# EAGLE design apa102-2020-stick (EAGLE 7.6.0)
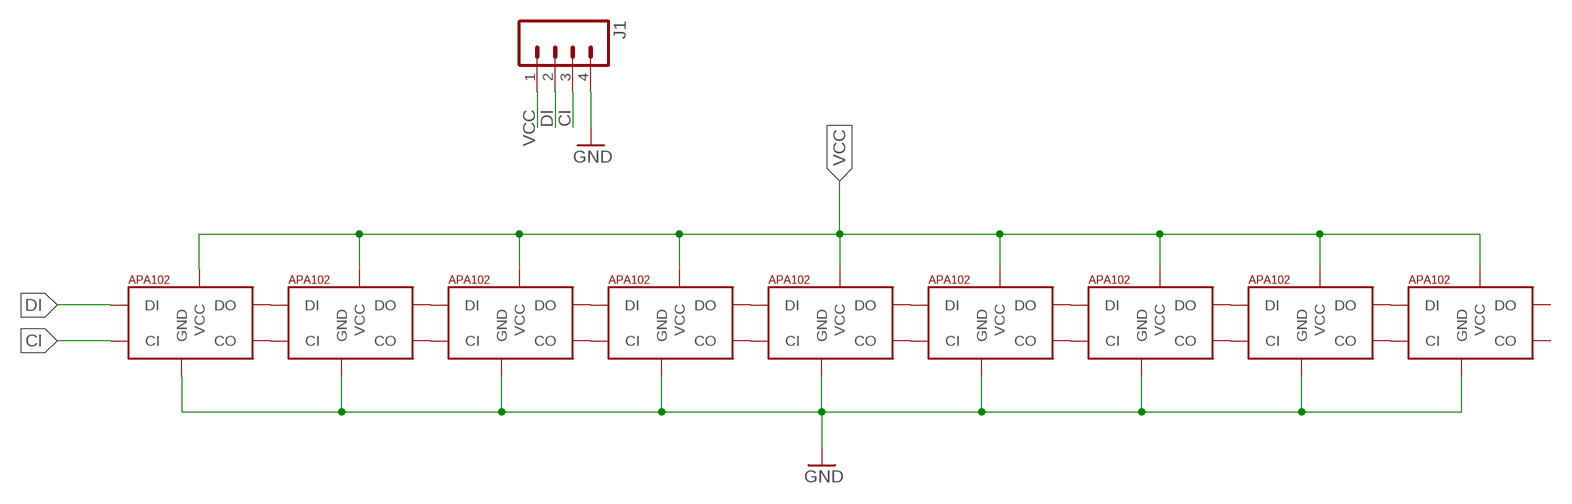
[diagram p0: schematic, sheet 1]

## Parts
J1  M04LOCK  [1X04_LOCK]
U$1  APA1022020  [APA102_2020]
U$2  APA1022020  [APA102_2020]
U$3  APA1022020  [APA102_2020]
U$4  APA1022020  [APA102_2020]
U$5  APA1022020  [APA102_2020]
U$6  APA1022020  [APA102_2020]
U$7  APA1022020  [APA102_2020]
U$8  APA1022020  [APA102_2020]
U$9  APA1022020  [APA102_2020]

## Nets
CI: J1.3 U$1.C_IN(CI)
DI: J1.2 U$1.D_IN(DI)
GND: J1.4 U$1.GND U$2.GND U$3.GND U$4.GND U$5.GND U$6.GND U$7.GND U$8.GND U$9.GND
N$1: U$1.D_OUT(DO) U$2.D_IN(DI)
N$2: U$1.CL_OUT(CO) U$2.C_IN(CI)
N$3: U$2.D_OUT(DO) U$3.D_IN(DI)
N$4: U$2.CL_OUT(CO) U$3.C_IN(CI)
N$5: U$3.D_OUT(DO) U$4.D_IN(DI)
N$6: U$3.CL_OUT(CO) U$4.C_IN(CI)
N$7: U$4.D_OUT(DO) U$5.D_IN(DI)
N$8: U$4.CL_OUT(CO) U$5.C_IN(CI)
N$9: U$5.D_OUT(DO) U$6.D_IN(DI)
N$10: U$5.CL_OUT(CO) U$6.C_IN(CI)
N$11: U$6.D_OUT(DO) U$7.D_IN(DI)
N$12: U$6.CL_OUT(CO) U$7.C_IN(CI)
N$13: U$7.D_OUT(DO) U$8.D_IN(DI)
N$14: U$7.CL_OUT(CO) U$8.C_IN(CI)
N$15: U$8.D_OUT(DO) U$9.D_IN(DI)
N$16: U$8.CL_OUT(CO) U$9.C_IN(CI)
VCC: J1.1 U$1.V_CC(VCC) U$2.V_CC(VCC) U$3.V_CC(VCC) U$4.V_CC(VCC) U$5.V_CC(VCC) U$6.V_CC(VCC) U$7.V_CC(VCC) U$8.V_CC(VCC) U$9.V_CC(VCC)
Unconnected: U$9.CL_OUT(CO) U$9.D_OUT(DO)

## Library data of the parts
J1 = SparkFun-Connectors:M04: Header 4 Standard 4-pin 0.1" header. Use with straight break away headers (SKU : PRT-00116), right angle break away headers (PRT-00553), swiss pins (PRT-00743), machine pins (PRT-00117), and female headers (PRT-00115). Molex polarized connector foot print use with SKU : PRT-08231 with associated crimp pins and housings. 1MM SMD Version SKU: PRT-10208; PROD_ID: CONN-09696
U$1-U$9 = jos-ph:APA102: APA102C 5050 RGB LED -- Adafruit DotStar Single LED Pixel Product Page: https://www.adafruit.com/products/2343 Datasheet: https://cdn-shop.adafruit.com/product-files/2343/APA102C.pdf

## Board
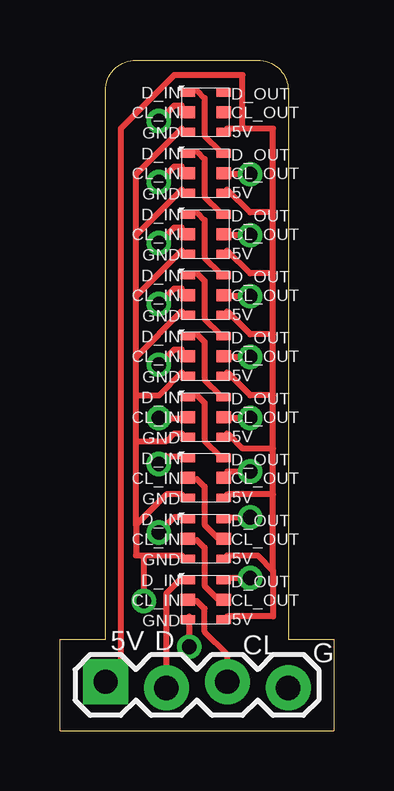
[diagram p1: board, top side]
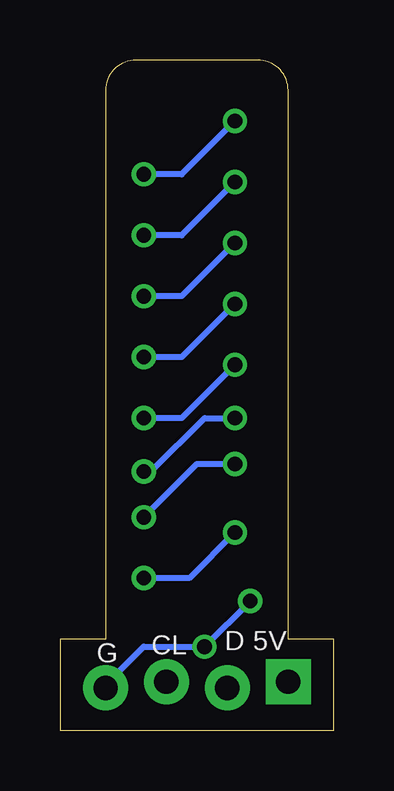
[diagram p2: board, bottom side, seen from below]

Size 11.43 x 27.94 mm. Coordinates in mm from the lower left corner, seen from the top.
Outline: 0,0 11.43,0 11.43,3.81 9.53,3.81 9.53,26.67 arc90 8.26,27.94 3.17,27.94 arc90 1.91,26.67 1.91,3.81 0,3.81 0,0
Copper layers (1*16): Top 0.035mm / dielectric 1.5mm / Bottom 0.035mm
Design rules "default": minimum track width 10mil, minimum drill 24mil, track to track 8mil, track to pad 8mil, pad to pad 8mil, via to via 8mil, smd to smd 8mil, copper to edge 40mil, drill to drill 8mil, minimum pad ring 10mil, minimum via ring 8mil, stop-mask expansion 4mil, vias tented up to drill 0mil, thermal gap 10mil

### Footprints (pad centres in the part's own frame; a part is rotated, then mirrored left to right if it is on the bottom)
1X04_LOCK = drill 1.016 pad 1.88 square: 1 0,0.127 | drill 1.016 pad 1.88: 2 2.54,-0.127; 3 5.08,0.127; 4 7.62,-0.127
APA102_2020 = smd 0.6 x 0.5: C_IN 0.25,1; CL_OUT 1.75,1 | smd 0.6 x 0.35: D_IN 0.25,1.825; D_OUT 1.75,1.825; GND 0.25,0.175; V_CC 1.75,0.175

### Placement (x,y rotation side)
J1  1.91,1.91 0 top
U$1  5.08,4.45 0 top
U$2  5.08,6.99 0 top
U$3  5.08,9.53 0 top
U$4  5.08,12.06 0 top
U$5  5.08,14.61 0 top
U$6  5.08,17.14 0 top
U$7  5.08,19.68 0 top
U$8  5.08,22.23 0 top
U$9  5.08,24.77 0 top

### Tracks (layer width: path | path; a pad name or v marks a point on that pad's centre or on a via)
CI
  Top 0.254: J1.3 6.99,3.17 6.03,4.13 6.03,5.08 5.71,5.4 5.4,5.4 U$1.C_IN
DI
  Top 0.254: J1.2 4.45,5.71 5.08,6.35 U$1.D_IN
GND  (via drill 0.61)
  Top 0.254: v5.4,3.49 5.4,4.76 U$1.GND | 3.49,7.3 3.17,7.3 3.17,8.57 | 3.49,7.3 5.08,7.3 U$2.GND | 3.17,8.57 4.45,9.84 5.08,9.84 U$3.GND | 3.17,12.06 4.45,12.06 4.76,12.38 5.08,12.38 U$4.GND | 3.17,8.57 3.17,12.06 | 3.17,13.97 4.13,13.97 5.08,14.92 U$5.GND | 3.17,12.06 3.17,13.97 | 3.17,15.56 5.08,17.46 U$6.GND | 3.17,13.97 3.17,15.56 | 3.17,18.1 5.08,20 U$7.GND | 3.17,15.56 3.17,18.1 | 3.17,20.64 5.08,22.54 U$8.GND | 3.17,18.1 3.17,20.64 | 3.17,20.64 3.17,23.18 5.08,25.08 U$9.GND | 3.49,7.3 v3.49,5.4
  Bottom 0.254: J1.4 9.53,1.91 7.94,3.49 v5.4,3.49 v3.49,5.4
N$1  (via drill 0.61)
  Top 0.254: v7.94,6.35 6.99,6.35 U$1.D_OUT | v4.13,8.26 4.76,8.89 5.08,8.89 U$2.D_IN
  Bottom 0.254: v7.94,6.35 6.03,6.35 v4.13,8.26
N$2
  Top 0.254: U$1.CL_OUT 6.67,5.4 6.03,6.03 6.03,7.62 5.71,7.94 5.4,7.94 U$2.C_IN
N$3  (via drill 0.61)
  Top 0.254: v4.13,11.11 4.13,11.43 5.08,11.43 U$3.D_IN | v7.94,8.89 6.99,8.89 U$2.D_OUT
  Bottom 0.254: v4.13,11.11 5.71,11.11 v7.94,8.89
N$4
  Top 0.254: U$2.CL_OUT 6.67,7.94 6.03,8.57 6.03,10.16 5.71,10.48 5.4,10.48 U$3.C_IN
N$5
  Top 0.254: U$3.D_OUT 6.67,11.43 6.03,12.06 6.03,13.65 5.71,13.97 5.4,13.97 U$4.D_IN
N$6  (via drill 0.61)
  Top 0.254: v4.13,13.02 5.08,13.02 U$4.C_IN | v7.94,10.79 6.99,10.79 6.99,10.48 U$3.CL_OUT
  Bottom 0.254: v4.13,13.02 5.4,13.02 7.62,10.79 v7.94,10.79
N$7
  Top 0.254: U$4.D_OUT 6.67,13.97 6.03,14.61 6.03,16.19 5.71,16.51 5.4,16.51 U$5.D_IN
N$8  (via drill 0.61)
  Top 0.254: v7.94,13.02 6.99,13.02 U$4.CL_OUT | v4.13,15.24 4.76,15.88 5.08,15.88 5.08,15.56 U$5.C_IN
  Bottom 0.254: v7.94,13.02 6.35,13.02 v4.13,15.24
N$9
  Top 0.254: U$5.D_OUT 6.67,16.51 6.03,17.14 6.03,18.73 5.71,19.05 5.4,19.05 U$6.D_IN
N$10  (via drill 0.61)
  Top 0.254: v7.94,15.56 6.99,15.56 U$5.CL_OUT | v4.13,17.78 4.76,18.41 5.08,18.41 5.08,18.1 U$6.C_IN
  Bottom 0.254: v7.94,15.56 6.35,15.56 v4.13,17.78
N$11
  Top 0.254: U$6.D_OUT 6.67,19.05 6.03,19.68 6.03,21.27 5.71,21.59 5.4,21.59 U$7.D_IN
N$12  (via drill 0.61)
  Top 0.254: v7.94,18.1 6.99,18.1 U$6.CL_OUT | v4.13,20.32 4.76,20.95 5.08,20.95 5.08,20.64 U$7.C_IN
  Bottom 0.254: v7.94,18.1 6.35,18.1 v4.13,20.32
N$13
  Top 0.254: U$7.D_OUT 6.67,21.59 6.03,22.23 6.03,23.81 5.71,24.13 5.4,24.13 U$8.D_IN
N$14  (via drill 0.61)
  Top 0.254: v7.94,20.64 6.99,20.64 U$7.CL_OUT | v4.13,22.86 4.76,23.5 5.08,23.5 5.08,23.18 U$8.C_IN
  Bottom 0.254: v7.94,20.64 6.35,20.64 v4.13,22.86
N$15
  Top 0.254: U$8.D_OUT 6.67,24.13 6.03,24.77 6.03,26.35 5.71,26.67 5.4,26.67 U$9.D_IN
N$16  (via drill 0.61)
  Top 0.254: v7.94,23.18 6.99,23.18 U$8.CL_OUT | v4.13,25.4 4.76,26.04 5.08,26.04 5.08,25.72 U$9.C_IN
  Bottom 0.254: v7.94,23.18 6.35,23.18 v4.13,25.4
VCC
  Top 0.254: 8.89,6.67 8.89,4.76 6.99,4.76 U$1.V_CC | 8.89,6.67 8.26,7.3 6.99,7.3 U$2.V_CC | 8.89,9.84 6.99,9.84 U$3.V_CC | 8.89,6.67 8.89,9.84 | 8.89,11.75 7.62,11.75 6.99,12.38 U$4.V_CC | 8.89,9.84 8.89,11.75 | 8.89,13.97 7.94,13.97 6.99,14.92 U$5.V_CC | 8.89,11.75 8.89,13.97 | 8.89,16.51 7.94,16.51 6.99,17.46 U$6.V_CC | 8.89,13.97 8.89,16.51 | 8.89,19.05 7.94,19.05 6.99,20 U$7.V_CC | 8.89,16.51 8.89,19.05 | 8.89,21.59 7.94,21.59 6.99,22.54 U$8.V_CC | 8.89,19.05 8.89,21.59 | 7.62,25.08 8.89,25.08 8.89,21.59 | 7.62,25.08 6.99,25.08 U$9.V_CC | 7.62,25.08 7.62,27.3 4.76,27.3 2.54,25.08 2.54,2.86 1.91,2.22 J1.1

### Text on the board
tNames: 5V | D | CL | G
bNames: 5V | D | CL | G